# Altium schematic sheet Main.SchDoc
size A4; SheetNumber: 1; SheetTotal: 3
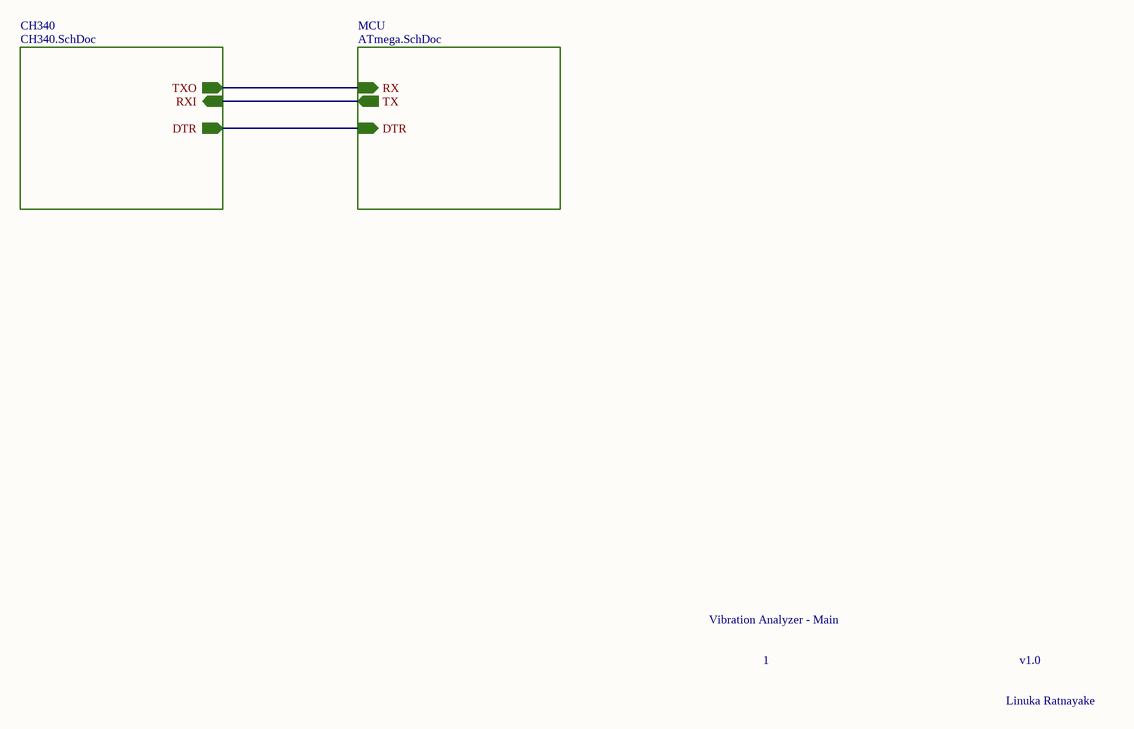
[diagram p0: Main.SchDoc]

## Sub-sheets
CH340 = CH340.SchDoc: TXO (out), RXI (in), DTR (out)
MCU = ATmega.SchDoc: DTR (in), RX (in), TX (out)

## Nets
(unnamed): sheet MCU/DTR, sheet CH340/DTR
(unnamed): sheet MCU/RX, sheet CH340/TXO
(unnamed): sheet MCU/TX, sheet CH340/RXI

## Notes on the sheet
- Vibration Analyzer - Main
- 1
- v1.0
- Linuka Ratnayake